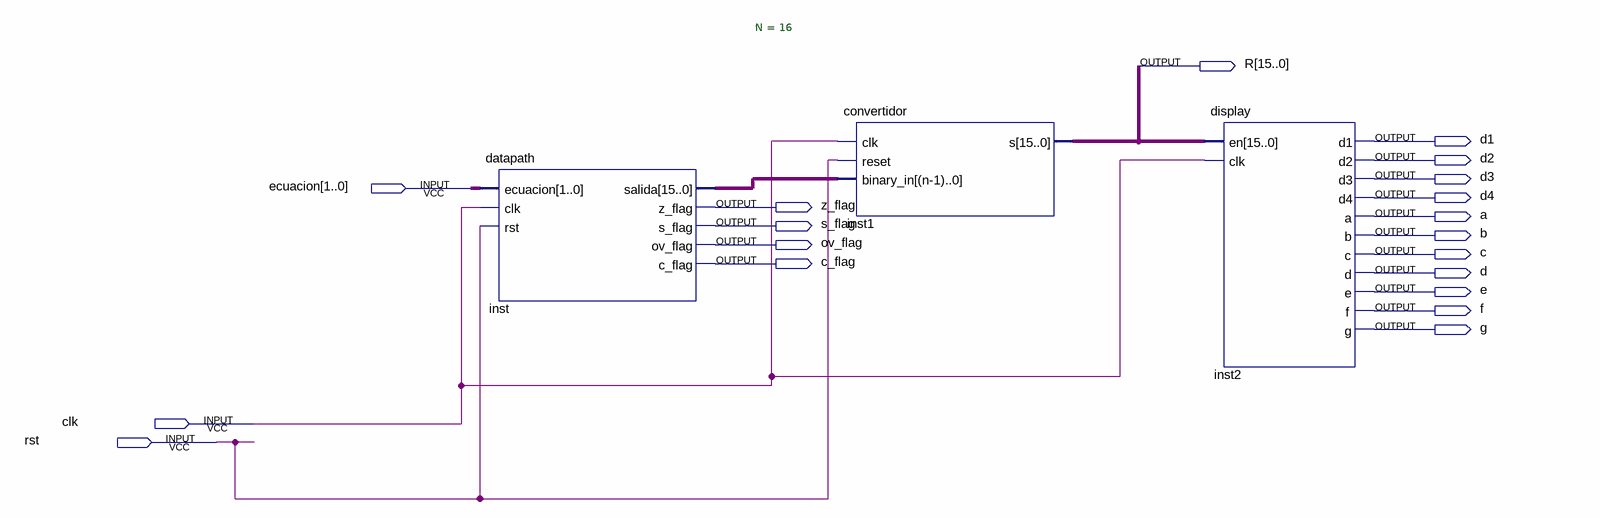
[diagram p0: schematic sheet]
// Quartus schematic practica3correccion.bdf as structural Verilog: 3 symbols, 19 pins
module practica3correccion (
  input  [1:0] ecuacion,
  input  clk,
  input  rst,
  output [15:0] R,
  output d1,
  output d2,
  output d3,
  output d4,
  output z_flag,
  output a,
  output s_flag,
  output b,
  output ov_flag,
  output c,
  output c_flag,
  output d,
  output e,
  output f,
  output g
);

  wire [15:0] inst_salida;

  datapath inst (
    .ecuacion(ecuacion), .clk(clk), .rst(rst), .salida(inst_salida), .z_flag(z_flag), .s_flag(s_flag),
    .ov_flag(ov_flag), .c_flag(c_flag));
  convertidor #(.N(16)) inst1 (.clk(clk), .reset(rst), .binary_in(inst_salida), .s(R));
  display inst2 (
    .en(R), .clk(clk), .d1(d1), .d2(d2), .d3(d3), .d4(d4), .a(a), .b(b), .c(c), .d(d), .e(e), .f(f), .g(g));
endmodule
